# EAGLE design TM1637_Display-Board_simple (EAGLE 7.4.0)
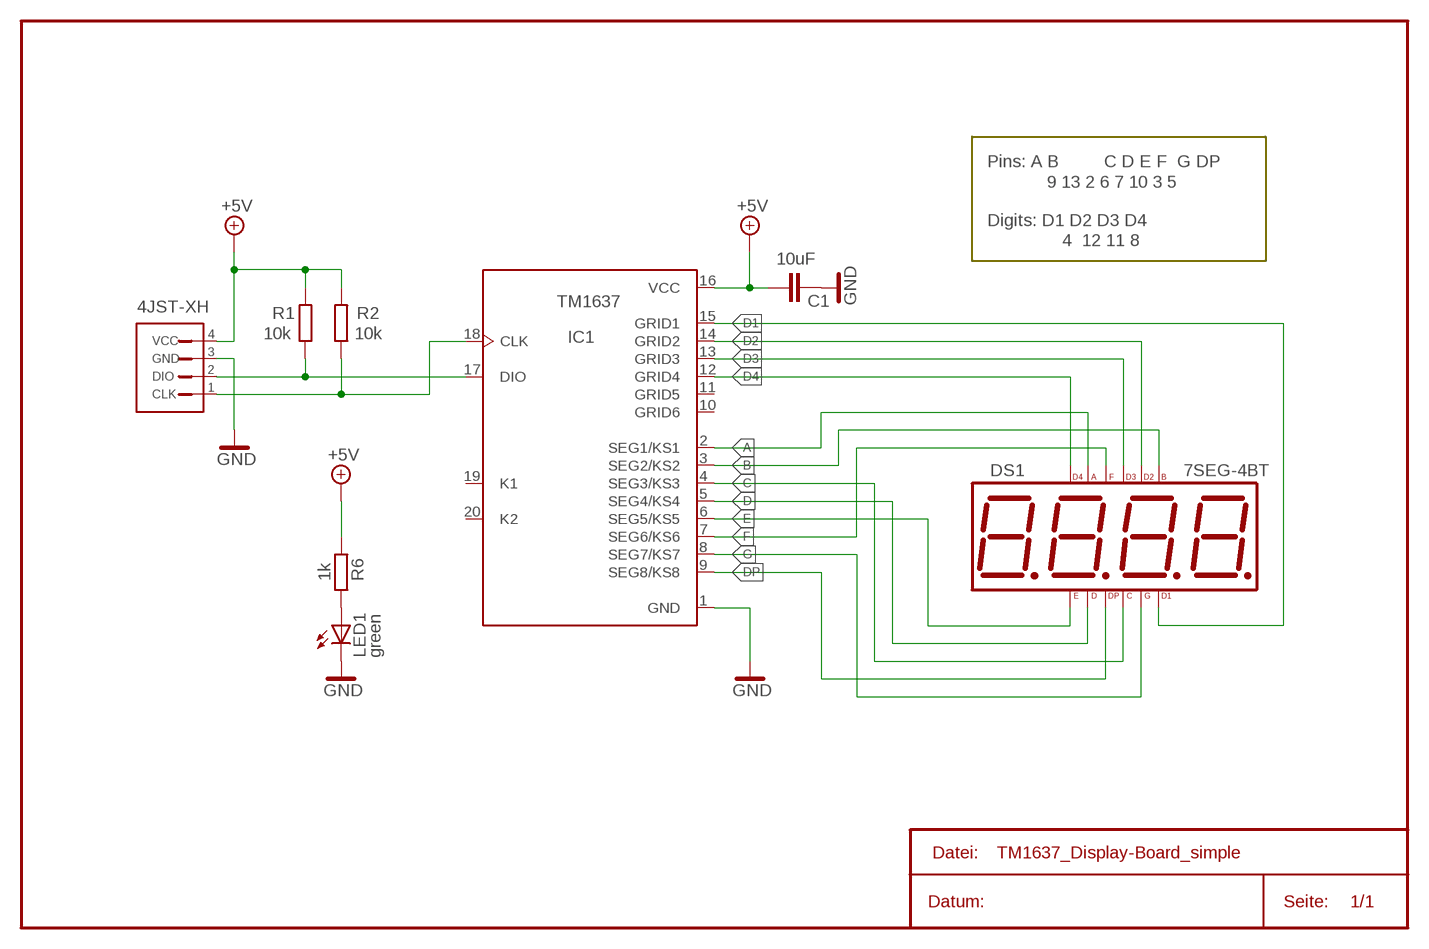
[diagram p0: schematic, sheet 1]

## Parts
1  4JST-XH  [4JST-XH]
C1  10uF  C-EUC0805  [C0805]
DS1  7SEG-4BT  [7SEG-14-4BIT]
IC1  TM1637  [SOP-20]
LED1  green  LEDCHIPLED_0603  [CHIPLED_0603]
R1  10k  R-EU_R0603  [R0603]
R2  10k  R-EU_R0603  [R0603]
R6  1k  R-EU_R0603  [R0603]

## Nets
+5V: 1.1 C1.1 IC1.16(VCC) R1.2 R2.2 R6.1
A: DS1.A IC1.2(SEG1/KS1)
B: DS1.B IC1.3(SEG2/KS2)
C: DS1.C IC1.4(SEG3/KS3)
CLK: 1.4 IC1.18(CLK) R2.1
D: DS1.D IC1.5(SEG4/KS4)
D1: DS1.D1 IC1.15(GRID1)
D2: DS1.D2 IC1.14(GRID2)
D3: DS1.D3 IC1.13(GRID3)
D4: DS1.D4 IC1.12(GRID4)
DIO: 1.3 IC1.17(DIO) R1.1
DP: DS1.DP IC1.9(SEG8/KS8)
E: DS1.E IC1.6(SEG5/KS5)
F: DS1.F IC1.7(SEG6/KS6)
G: DS1.G IC1.8(SEG7/KS7)
GND: 1.2 C1.2 IC1.1(GND) LED1.C
N$1: LED1.A R6.2
Unconnected: IC1.10(GRID6) IC1.11(GRID5) IC1.19(K1) IC1.20(K2)

## Notes on the sheet
- Pins: A B | C D E F  G DP
- 9 13 2 6 7 10 3 5
- Digits: D1 D2 D3 D4
- 4  12 11 8
- 4
- VCC
- 3
- GND
- 2
- DIO
- 1
- CLK

## Library data of the parts
1 = con-jst:4JST-XH: CONNECTOR
C1 = rcl1:C-EU: CAPACITOR, European symbol
DS1 = special:7SEG-4BT: 7-segment LED-Display - 4 bit LED-height: 14 mm Dimensions: 20 x 50 x 6 mm
IC1 = special:TM1637: LED Drive Control Special Circuit • Applied power CMOS technique • The display mode (8 segments*6 bit) supports output by common anode LED • Keyboard scan (8×2bit), with enhanced identification circuit with anti-interference keys • Luminance adjustment circuit (adjustable 8 duty ratio) • Two-wire serial interface (CLK, DIO) • Oscillating type: Built-in RC oscillator • Built-in power-on reset circuit • Built-in automatic blanking circuit • Package type: DIP20/SOP20
LED1 = arduino_Uno_Rev3-02-TH:LED: LED OSRAM: - CHIPLED LG R971, LG N971, LY N971, LG Q971, LY Q971, LO R971, LY R971 LH N974, LH R974 LS Q976, LO Q976, LY Q976 LO Q996 - Hyper CHIPLED LW Q18S LB Q993, LB Q99A, LB R99A - SideLED LS A670, LO A670, LY A670, LG A670, LP A670 LB A673, LV A673, LT A673, LW A673 LH A674 LY A675 LS A676, LA A676, LO A676, LY A676, LW A676 LS A679, LY A679, LG A679 - Hyper Micro SIDELED® LS Y876, LA Y876, LO Y876, LY Y876 LT Y87S - SmartLED LW L88C, LW L88S LB L89C, LB L89S, LG L890 LS L89K, LO L89K, LY L89K LS L896, LA L896, LO L896, LY L896 - TOPLED LS T670, LO T670, LY T670, LG T670, LP T670 LSG T670, LSP T670, LSY T670, LOP T670, LYG T670 LG T671, LOG T671, LSG T671 LB T673, LV T673, LT T673, LW T673 LH T674 LS T676, LA T676, LO T676, LY T676, LB T676, LH T676, LSB T676, LW T676 LB T67C, LV T67C, LT T67C, LS T67K, LO T67K, LY T67K, LW E67C LS E67B, LA E67B, LO E67B, LY E67B, LB E67C, LV E67C, LT E67C LW T67C LS T679, LY T679, LG T679 LS T770, LO T770, LY T770, LG T770, LP T770 LB T773, LV T773, LT T773, LW T773 LH T774 LS E675, LA E675, LY E675, LS T675 LS T776, LA T776, LO T776, LY T776, LB T776 LHGB T686 LT T68C, LB T68C - Hyper Mini TOPLED® LB M676 - Mini TOPLED Santana® LG M470 LS M47K, LO M47K, LY M47K Source: http://www.osram.convergy.de LUXEON: - LUMILED® LXK2-PW12-R00, LXK2-PW12-S00, LXK2-PW14-U00, LXK2-PW14-V00 LXK2-PM12-R00, LXK2-PM12-S00, LXK2-PM14-U00 LXK2-PE12-Q00, LXK2-PE12-R00, LXK2-PE12-S00, LXK2-PE14-T00, LXK2-PE14-U00 LXK2-PB12-K00, LXK2-PB12-L00, LXK2-PB12-M00, LXK2-PB14-N00, LXK2-PB14-P00, LXK2-PB14-Q00 LXK2-PR12-L00, LXK2-PR12-M00, LXK2-PR14-Q00, LXK2-PR14-R00 LXK2-PD12-Q00, LXK2-PD12-R00, LXK2-PD12-S00 LXK2-PH12-R00, LXK2-PH12-S00 LXK2-PL12-P00, LXK2-PL12-Q00, LXK2-PL12-R00 Source: www.luxeon.com KINGBRIGHT: KA-3528ASYC Source: www.kingbright.com
R1 R2 R6 = rcl1:R-EU_: RESISTOR, European symbol

## Net classes
0 default: width 0.203 mm
1 vcc: width 0.254 mm

## Board
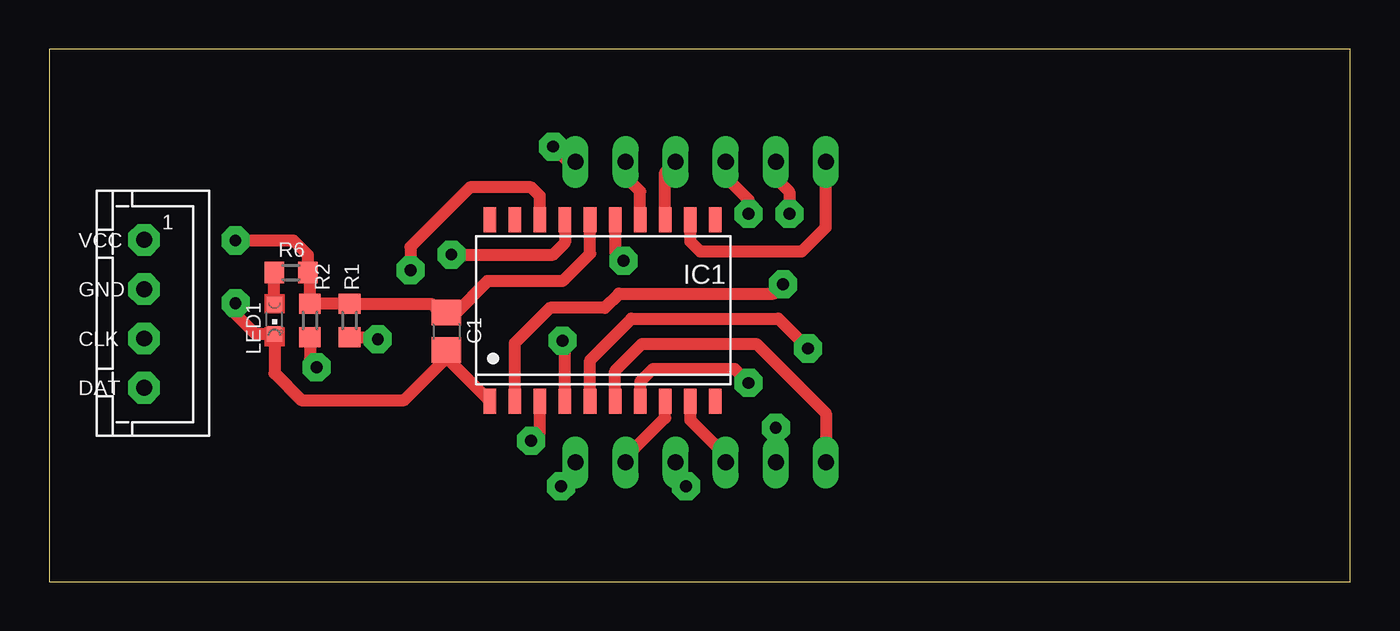
[diagram p1: board, top side]
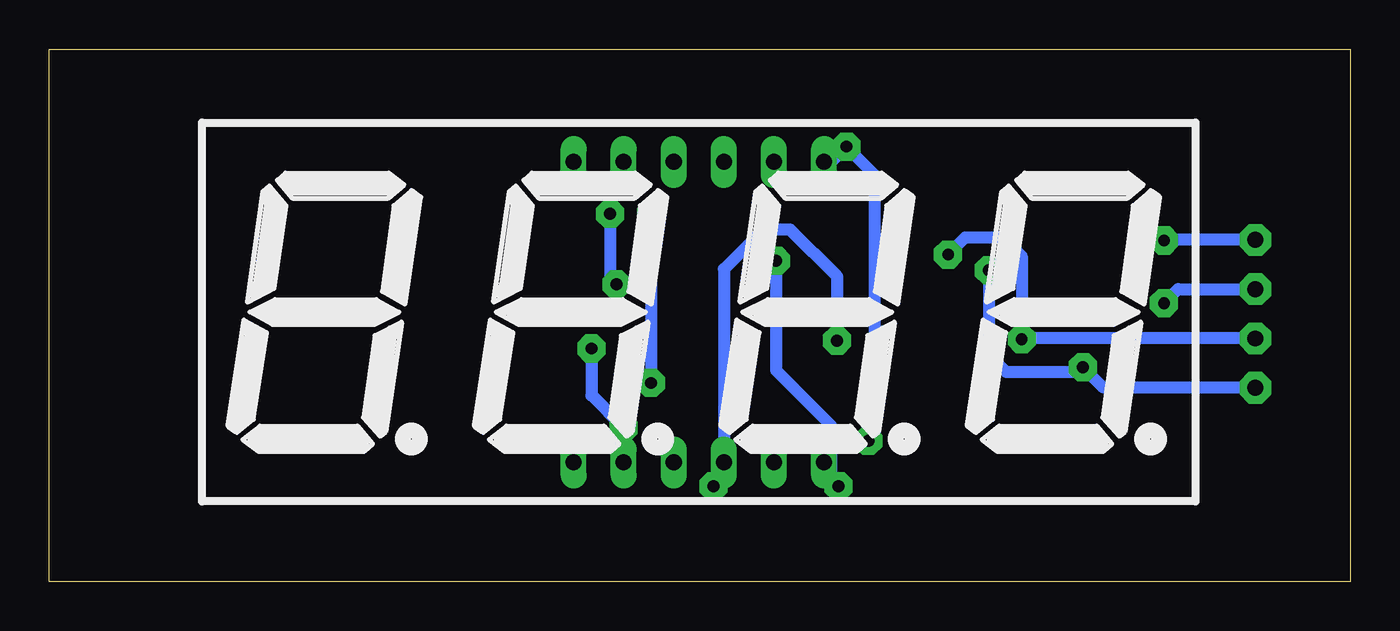
[diagram p2: board, bottom side, seen from below]

Size 66 x 27 mm. Coordinates in mm from the lower left corner, seen from the top.
Outline: 0,0 66,0 66,27 0,27 0,0
Copper layers (1*16): Top 0.035mm / dielectric 1.5mm / Bottom 0.035mm
Design rules "default": minimum track width 10mil, minimum drill 24mil, track to track 8mil, track to pad 8mil, pad to pad 8mil, via to via 8mil, smd to smd 8mil, copper to edge 40mil, drill to drill 8mil, minimum pad ring 10mil, minimum via ring 8mil, stop-mask expansion 4mil, vias tented up to drill 0mil, thermal gap 10mil

### Footprints (pad centres in the part's own frame; a part is rotated, then mirrored left to right if it is on the bottom)
4JST-XH = drill 0.8 pad 1.6 octagon: 1 0,0; 2 2.5,0; 3 5,0; 4 7.5,0
C0805 = smd 1.3 x 1.5: 1 -0.95,0; 2 0.95,0
7SEG-14-4BIT = drill 0.813 long: A -2.54,7.62; B 7.62,7.62; C 2.54,-7.62; D -2.54,-7.62; D1 7.62,-7.62; D2 5.08,7.62; D3 2.54,7.62; D4 -5.08,7.62; DP 0,-7.62; E -5.08,-7.62; F 0,7.62; G 5.08,-7.62
SOP-20 = smd 0.635 x 1.27: 1 -5.75,-4.61; 2 -4.48,-4.61; 3 -3.21,-4.61; 4 -1.94,-4.61; 5 -0.67,-4.61; 6 0.6,-4.61; 7 1.87,-4.61; 8 3.14,-4.61; 9 4.41,-4.61; 10 5.68,-4.61; 11 5.68,4.61; 12 4.41,4.61; 13 3.14,4.61; 14 1.87,4.61; 15 0.6,4.61; 16 -0.67,4.61; 17 -1.94,4.61; 18 -3.21,4.61; 19 -4.48,4.61; 20 -5.75,4.61
CHIPLED_0603 = smd 0.8 x 0.8: A 0,-0.75; C 0,0.75
R0603 = smd 1 x 1.1: 1 -0.85,0; 2 0.85,0

### Placement (x,y rotation side)
1  4.81,17.34 270 top
C1  20.15,12.7 270 top
DS1  34.32,13.68 0 bottom
IC1  28.1,13.76 0 top
LED1  11.42,13.31 180 top
R1  15.24,13.24 90 top
R2  13.23,13.24 90 top
R6  12.26,15.68 180 top

### Tracks (layer width: path | path; a pad name or v marks a point on that pad's centre or on a via)
+5V  (via drill 0.6 pad 1.42)
  Top 0.61: IC1.16 27.43,16.64 26.03,15.24 22.21,15.24 20.63,13.65 C1.1 19.83,13.65 19.39,14.09 R1.2 R2.2 13.23,15.56 R6.1 13.12,16.57 12.38,17.3 v9.45,17.3
  Bottom 0.61: 1.1 9.41,17.34 v9.45,17.3
A  (via drill 0.6 pad 1.42)
  Top 0.61: IC1.2 23.62,12.12 25.4,13.89 28.18,13.89 28.89,14.61 36.75,14.61 v37.23,15.08 | DS1.A 36.86,20.45 37.54,19.76 v37.54,18.65
  Bottom 0.61: v37.54,18.65 37.54,15.4 v37.23,15.08
B  (via drill 0.6 pad 1.42)
  Top 0.61: v24.45,7.14 24.89,7.59 IC1.3 | v25.56,22.07 26.33,21.3 DS1.B
  Bottom 0.61: v25.56,22.07 24.13,20.64 24.13,7.46 v24.45,7.14
B2
  Bottom 0.61: 25.56,22.07 26.33,21.3 26.7,21.3
C  (via drill 0.6 pad 1.42)
  Top 0.61: v32.31,4.84 31.78,5.37 DS1.C | IC1.4 26.16,12.09 v26.04,12.22
  Bottom 0.61: 31.78,5.37 v32.31,4.84 | v26.04,12.22 26.04,15.48 28.42,17.86 29.77,17.86 31.78,15.85 DS1.C
CLK  (via drill 0.6 pad 1.42)
  Top 0.61: IC1.18 24.89,19.56 24.45,20 21.34,20 18.32,16.99 v18.32,15.8 | R2.1 13.23,11.29 v13.56,10.87
  Bottom 0.61: 1.4 12.52,9.84 v13.56,10.87 13.32,10.64 17.46,10.64 18.32,11.5 v18.32,15.8
D  (via drill 0.6 pad 1.42)
  Top 0.61: IC1.5 27.43,11.24 29.53,13.34 36.99,13.34 v38.5,11.83 | v36.86,7.81 DS1.D
  Bottom 0.61: v38.5,11.83 38.5,9.45 v36.86,7.81
D1  (via drill 0.6 pad 1.42)
  Top 0.61: IC1.15 28.7,16.7 v29.13,16.27 | DS1.D1 26.7,5.58 v25.96,4.84
  Bottom 0.61: v29.13,16.27 29.13,10.72 26.35,7.94 26.35,5.24 v25.96,4.84
D2
  Top 0.61: IC1.14 29.97,19.79 29.24,20.53 DS1.D2
D3
  Top 0.61: IC1.13 31.24,20.76 DS1.D3
D4
  Top 0.61: IC1.12 32.51,17.25 33.02,16.75 38.18,16.75 39.4,17.97 DS1.D4
DIO  (via drill 0.6 pad 1.42)
  Top 0.61: IC1.17 26.16,17.2 25.56,16.59 v20.4,16.59 | R1.1 16.58,12.39 v16.67,12.3
  Bottom 0.61: v20.4,16.59 19.53,17.46 17.62,17.46 16.67,16.51 v16.67,12.3 16.64,12.34 1.3
DP
  Top 0.61: IC1.9 32.51,8.21 34.32,6.4 DS1.DP
E
  Top 0.61: IC1.6 28.7,10.69 30.08,12.06 35.88,12.06 39.4,8.54 DS1.E
F  (via drill 0.6 pad 1.42)
  Top 0.61: DS1.F 34.32,20.53 35.48,19.37 v35.48,18.65 | IC1.7 29.97,10.13 30.64,10.79 34.77,10.79 v35.48,10.08
  Bottom 0.61: v35.48,18.65 v35.48,10.08
G
  Top 0.61: DS1.G 29.24,6.3 31.24,8.3 IC1.8
GND  (via drill 0.6 pad 1.42)
  Top 0.61: C1.2 20.15,11.35 | 20.15,11.35 IC1.1 | 20.15,11.35 18.01,9.21 12.78,9.21 11.42,10.56 LED1.C 10.46,12.56 9.45,13.57 v9.45,14.13
  Bottom 0.61: v9.45,14.13 8.74,14.84 1.2
N$1
  Top 0.61: LED1.A 11.41,13.99 R6.2
(copper drawn outside any net)
  shapes: Top area x2

### Text on the board
tNames: VCC / GND / CLK / DAT